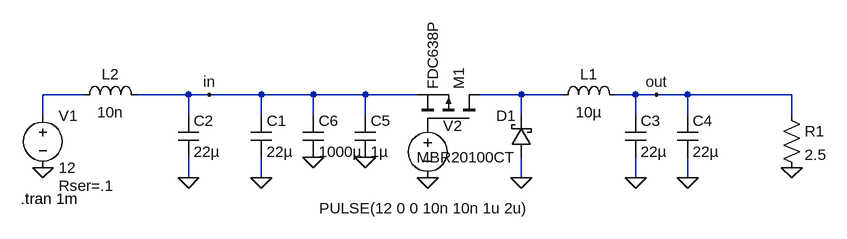
[diagram p0: schematic 5V_dc_dc.asc]
5V_dc_dc.asc, the LTspice schematic file:
Version 4
SHEET 1 1132 680
WIRE -16 112 -80 112
WIRE 144 112 64 112
WIRE 176 112 144 112
WIRE 256 112 176 112
WIRE 336 112 256 112
WIRE 416 112 336 112
WIRE 496 112 416 112
WIRE 656 112 592 112
WIRE 720 112 656 112
WIRE 832 112 800 112
WIRE 864 112 832 112
WIRE 912 112 864 112
WIRE 1072 112 912 112
WIRE -80 144 -80 112
WIRE 144 144 144 112
WIRE 256 144 256 112
WIRE 336 144 336 112
WIRE 416 144 416 112
WIRE 656 144 656 112
WIRE 832 144 832 112
WIRE 912 144 912 112
WIRE 1072 144 1072 112
WIRE 144 240 144 208
WIRE 256 240 256 208
WIRE 656 240 656 208
WIRE 832 240 832 208
WIRE 912 240 912 208
FLAG 512 240 0
FLAG -80 224 0
FLAG 1072 224 0
FLAG 144 240 0
FLAG 256 240 0
FLAG 832 240 0
FLAG 912 240 0
FLAG 176 112 in
FLAG 864 112 out
FLAG 656 240 0
FLAG 416 208 0
FLAG 336 208 0
SYMBOL voltage -80 128 R0
WINDOW 123 0 0 Left 2
WINDOW 39 24 124 Left 2
SYMATTR InstName V1
SYMATTR Value 12
SYMATTR SpiceLine Rser=.1
SYMBOL pmos 592 160 M270
SYMATTR InstName M1
SYMATTR Value FDC638P
SYMBOL voltage 512 144 R0
WINDOW 3 -167 143 Left 2
WINDOW 123 0 0 Left 2
WINDOW 39 0 0 Left 2
SYMATTR InstName V2
SYMATTR Value PULSE(12 0 0 10n 10n 1u 2u)
SYMBOL ind 704 128 R270
WINDOW 0 32 56 VTop 2
WINDOW 3 5 56 VBottom 2
SYMATTR InstName L1
SYMATTR Value 10µ
SYMATTR SpiceLine Rser=.05
SYMBOL res 1056 128 R0
SYMATTR InstName R1
SYMATTR Value 2.5
SYMBOL cap 128 144 R0
SYMATTR InstName C2
SYMATTR Value 22µ
SYMATTR SpiceLine Rser=.05 Lser=5n
SYMBOL ind -32 128 R270
WINDOW 0 32 56 VTop 2
WINDOW 3 5 56 VBottom 2
SYMATTR InstName L2
SYMATTR Value 10n
SYMBOL cap 240 144 R0
SYMATTR InstName C1
SYMATTR Value 22µ
SYMATTR SpiceLine Rser=.05 Lser=7n
SYMBOL cap 816 144 R0
SYMATTR InstName C3
SYMATTR Value 22µ
SYMATTR SpiceLine Rser=.05 Lser=5n
SYMBOL cap 896 144 R0
SYMATTR InstName C4
SYMATTR Value 22µ
SYMATTR SpiceLine Rser=.05 Lser=7n
SYMBOL schottky 672 208 R180
WINDOW 0 24 64 Left 2
WINDOW 3 24 0 Left 2
SYMATTR InstName D1
SYMATTR Value MBR20100CT
SYMATTR Description Diode
SYMATTR Type diode
SYMBOL cap 400 144 R0
SYMATTR InstName C5
SYMATTR Value 1µ
SYMATTR SpiceLine Rser=.005 Lser=2n
SYMBOL cap 320 144 R0
SYMATTR InstName C6
SYMATTR Value 1000µ
SYMATTR SpiceLine Rser=2 Lser=20n
TEXT -114 272 Left 2 !.tran 1m

The netlist it stands for:
* 5V_dc_dc.asc
V1 N001 0 12 Rser=.1
M1 N002 P001 in in FDC638P
V2 P001 0 PULSE(12 0 0 10n 10n 1u 2u)
L1 N002 out 10µ Rser=.05
R1 out 0 2.5
C2 in 0 22µ Rser=.05 Lser=5n
L2 N001 in 10n
C1 in 0 22µ Rser=.05 Lser=7n
C3 out 0 22µ Rser=.05 Lser=5n
C4 out 0 22µ Rser=.05 Lser=7n
D1 0 N002 MBR20100CT
C5 in 0 1µ Rser=.005 Lser=2n
C6 in 0 1000µ Rser=2 Lser=20n
.model D D
.lib standard.dio
.model NMOS NMOS
.model PMOS PMOS
.lib standard.mos
.tran 1m
.backanno
.end